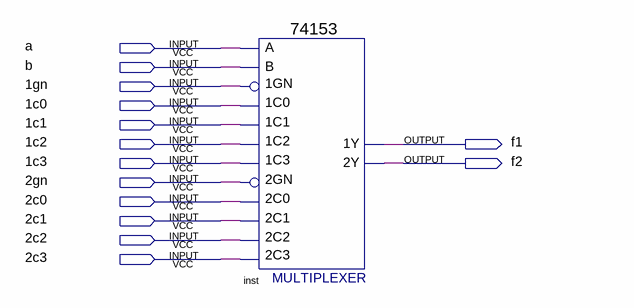
[diagram p0: schematic sheet]
// Quartus schematic 74153test.bdf as structural Verilog: 1 symbols, 14 pins
module \74153test  (
  input  a,
  input  b,
  input  \1gn ,
  input  \1c0 ,
  input  \1c1 ,
  input  \1c2 ,
  input  \1c3 ,
  input  \2gn ,
  input  \2c0 ,
  input  \2c1 ,
  input  \2c2 ,
  input  \2c3 ,
  output f1,
  output f2
);

  \74153  inst (
    .\1C1 (\1c1 ), .\1GN (\1gn ), .\1C0 (\1c0 ), .\2C0 (\2c0 ), .\2GN (\2gn ), .\2C2 (\2c2 ), .\1C2 (\1c2 ),
    .\1C3 (\1c3 ), .B(b), .A(a), .\2C1 (\2c1 ), .\2C3 (\2c3 ), .\1Y (f1), .\2Y (f2));
endmodule
